# Altium project DCDC_SAUVC26_PCB.PrjPcb
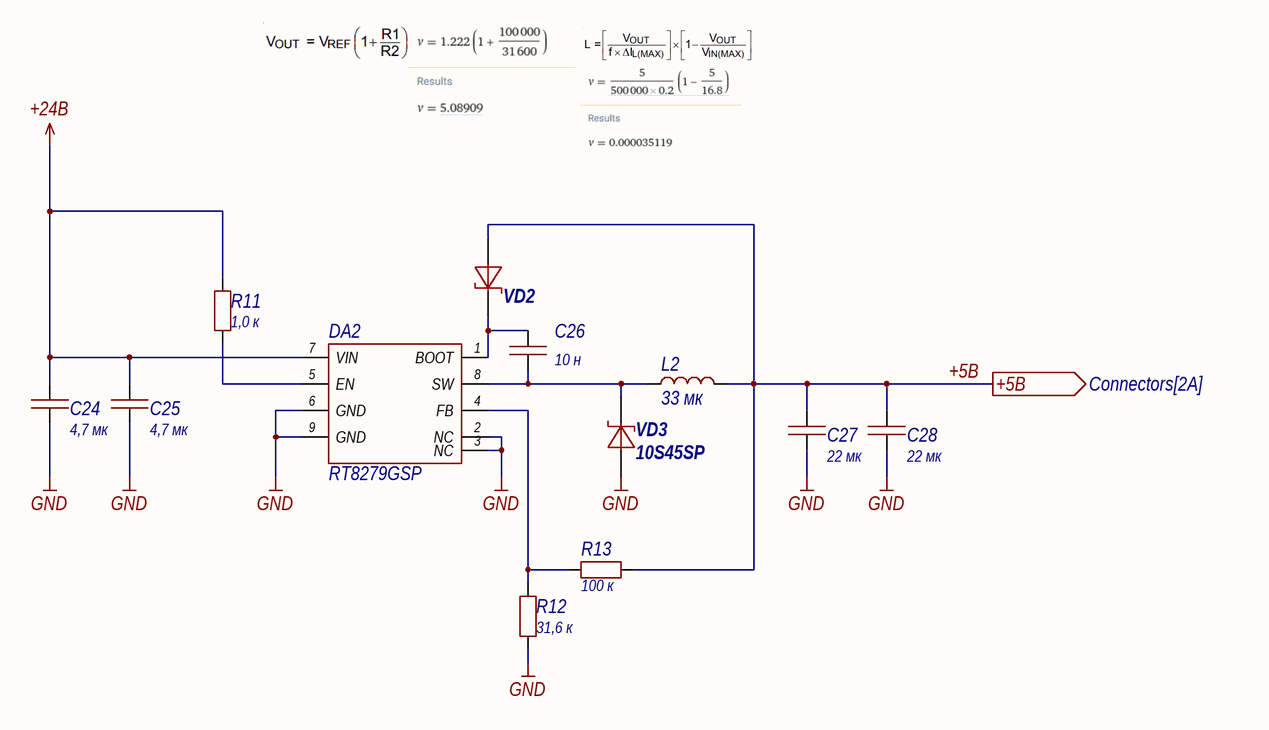
[diagram p0: DCDC_5V.SchDoc]
CheckedBy: Карманов С.; Decimal_Number_PCB: ГИДР.123456.014; Decimal_Number_Shematic: ГИДР.123456.014; DrawnBy: Михайловский Г.; Release_Date: 14.09.2025; Title: Плата преобразователей постоянного тока; Version: 01
5 sheets, 96 parts. Net scope: flat (ports and power ports of the same name join across sheets).
Board file: DCDC_SAUVC26.PcbDoc
Sheets:
  DCDC_5V.SchDoc
  DCDC_12V_Servo.SchDoc
  DCDC_12V.SchDoc
  DCDC_35V.SchDoc
  Connectors.SchDoc

## Sheet DCDC_5V.SchDoc: Плата преобразователей постоянного тока
size 420 x 297 mm; SheetNumber: 1; SheetTotal: 5

### Parts
C24  value 4,7 мк  [1206C]  (hidden comment: Capacitor)
C25  value 4,7 мк  [1206C]  (hidden comment: Capacitor)
C26  value 10 н  [0603C]  (hidden comment: Capacitor)
C27  value 22 мк  [1210C]  (hidden comment: Capacitor)
C28  value 22 мк  [1210C]  (hidden comment: Capacitor)
DA2  RT8279GSP  [8SOP(Exposed_Pad)]
L2  value 33 мк  [IHLP-4040]  (hidden comment: IHLP4040DZER330M11)
R11  value 1,0 к  [0603R]  (hidden comment: Resistor)
R12  value 31,6 к  [0603R]  (hidden comment: Resistor)
R13  value 100 к  [0603R]  (hidden comment: Resistor)
VD2  BAT54WS  [SOD-323]  (value not drawn)
VD3  10S45SP  [TO-277]

### Ports
+5В (out, see Connectors[2A])

### Nets
+5В: C27.2 C28.2 L2.2 R13.2 VD2.1 ; port +5В
+24В: C24.2 C25.2 DA2.7(VIN) R11.2
GND: C24.1 C25.1 C27.1 C28.1 DA2.2(NC) DA2.3(NC) DA2.6(GND) DA2.9(GND) R12.1 VD3.1
NetC26_1: C26.1 DA2.8(SW) L2.1 VD3.2
NetC26_2: C26.2 DA2.1(BOOT) VD2.2
NetDA2_4: DA2.4(FB) R12.2 R13.1
NetDA2_5: DA2.5(EN) R11.1

### Notes on the sheet
- Перв. примен.
- Справ. №
- Подп. и дата
- Инв. № дубл.
- Взам. инв. №
- Разраб.
- Изм.
- Лист
- № докум.
- Подп.
- Дата
- Лит.
- Масса
- Масштаб
- Пров.
- Т.контр.
- Схема электрическая принципиальная
- Листов
- Инв. № подл.
- Утв.
- Н.контр.
- Копировал
- Формат А3

### Library data of the parts
C24 C25 = Capacitor_4,7u_10_50V_X7R_1206C: Конденсатор; Library Path2: Schematic\Capacitor.SchLib; Tolerance: 0,1; Voltage (V): 50; Dielectric: X7R; Capacity (nF): 4700; Part Number: Capacitor_4,7u_10_50V_X7R_1206C
C26 = Capacitor_10n_10_50V_X7R_0603C: Конденсатор; Library Path2: Schematic\Capacitor.SchLib; Tolerance: 0,1; Voltage (V): 50; Dielectric: X7R; Capacity (nF): 10; Part Number: Capacitor_10n_10_50V_X7R_0603C
C27 C28 = Capacitor_22u_10_25V_X7R_1210C: Конденсатор; Library Path2: Schematic\Capacitor.SchLib; Tolerance: 0,1; Voltage (V): 25; Dielectric: X7R; Capacity (nF): 22000; Part Number: Capacitor_22u_10_25V_X7R_1210C
DA2 = RT8279GSP: Преобразователь постоянного тока понижающий подстраиваемый выход 5А; Part Number: RT8279GSP
L2 = IHLP4040DZER330M11: ЧИП-индуктивность экранированная 33мкГн ±20% 4,4A 94,5мОм 4040; Inductance (μH): 33; Current (A): 4,4; Part Number: IHLP4040DZER330M11
R11 = Resistor_1.0k_1_0603: Резистор номиналом 1,0 кОм и точностью 1%; Power: *; Part Number: Resistor_1.0k_1_0603; Tolerance: 1%
R12 = Resistor_31.6k_1_0603: Резистор номиналом 31,6 кОм и точностью 1%; Power: *; Part Number: Resistor_31.6k_1_0603; Tolerance: 1%
R13 = Resistor_100k_1_0603: Резистор номиналом 100 кОм и точностью 1%; Power: *; Part Number: Resistor_100k_1_0603; Tolerance: 1%
VD2 = BAT54WS: Диод шоттки на 30 В, ном. ток 0.2 А; Voltage nominal (V): 30; Current (A): 0.2; Part Number: BAT54WS
VD3 = 10S45SP: Диод шоттки на 45 В, ном. ток 10 А; Voltage nominal (V): 45; Current (A): 10; Part Number: 10S45SP

## Sheet DCDC_12V_Servo.SchDoc: Плата преобразователей постоянного тока
size 420 x 297 mm; SheetNumber: 2; SheetTotal: 5
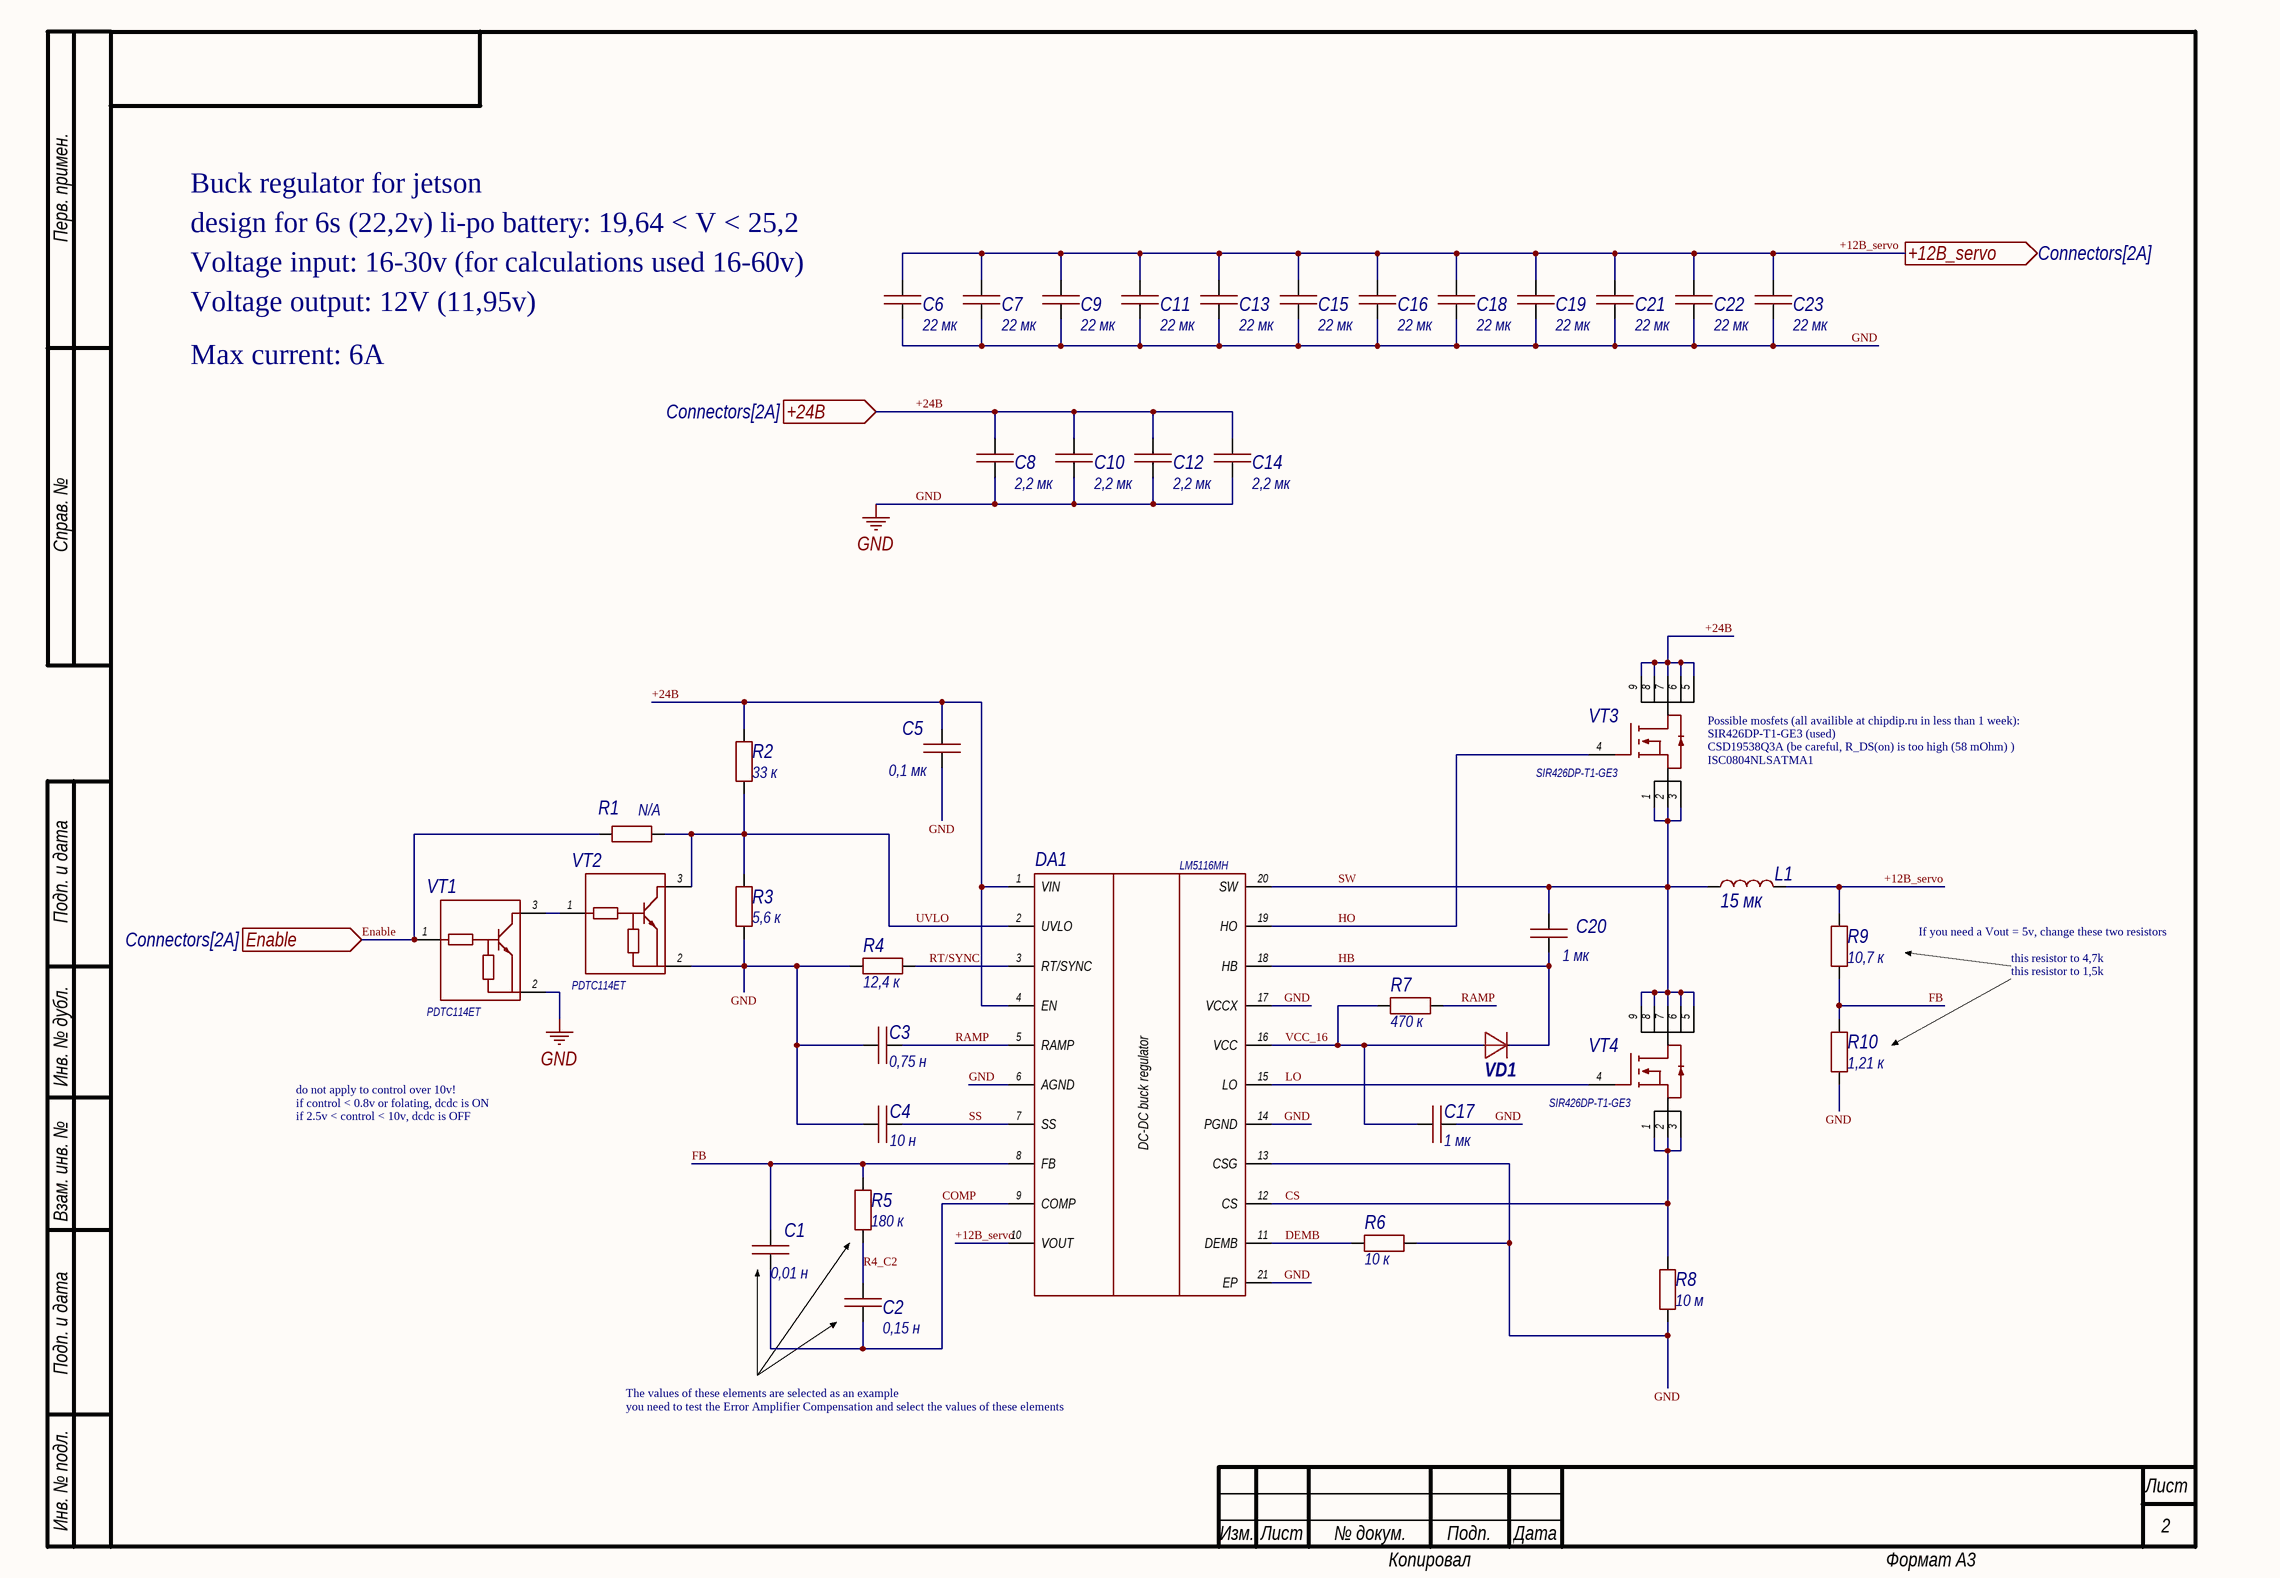
[diagram p1: DCDC_12V_Servo.SchDoc]

### Parts
C1  value 0,01 н  [0603C]  (hidden comment: Capacitor)
C2  value 0,15 н  [0603C]  (hidden comment: Capacitor)
C3  value 0,75 н  [0603C]  (hidden comment: Capacitor)
C4  value 10 н  [0603C]  (hidden comment: Capacitor)
C5  value 0,1 мк  [0603C]  (hidden comment: Capacitor)
C6  value 22 мк  [1210C]  (hidden comment: Capacitor)
C7  value 22 мк  [1210C]  (hidden comment: Capacitor)
C8  value 2,2 мк  [1206C]  (hidden comment: Capacitor)
C9  value 22 мк  [1210C]  (hidden comment: Capacitor)
C10  value 2,2 мк  [1206C]  (hidden comment: Capacitor)
C11  value 22 мк  [1210C]  (hidden comment: Capacitor)
C12  value 2,2 мк  [1206C]  (hidden comment: Capacitor)
C13  value 22 мк  [1210C]  (hidden comment: Capacitor)
C14  value 2,2 мк  [1206C]  (hidden comment: Capacitor)
C15  value 22 мк  [1210C]  (hidden comment: Capacitor)
C16  value 22 мк  [1210C]  (hidden comment: Capacitor)
C17  value 1 мк  [0603C]  (hidden comment: Capacitor)
C18  value 22 мк  [1210C]  (hidden comment: Capacitor)
C19  value 22 мк  [1210C]  (hidden comment: Capacitor)
C20  value 1 мк  [0603C]  (hidden comment: Capacitor)
C21  value 22 мк  [1210C]  (hidden comment: Capacitor)
C22  value 22 мк  [1210C]  (hidden comment: Capacitor)
C23  value 22 мк  [1210C]  (hidden comment: Capacitor)
DA1  LM5116MH  [HTSSOP-20]
L1  value 15 мк  [SPRH127]  (hidden comment: CDSPRH127-150M)
R1  Resistor  [0603R]  (value not drawn)
R2  value 33 к  [0603R]  (hidden comment: Resistor)
R3  value 5,6 к  [0603R]  (hidden comment: Resistor)
R4  value 12,4 к  [0603R]  (hidden comment: Resistor)
R5  value 180 к  [0603R]  (hidden comment: Resistor)
R6  value 10 к  [0603R]  (hidden comment: Resistor)
R7  value 470 к  [0603R]  (hidden comment: Resistor)
R8  value 10 м  [1210R]  (hidden comment: Resistor)
R9  value 10,7 к  [0603R]  (hidden comment: Resistor)
R10  value 1,21 к  [0603R]  (hidden comment: Resistor)
VD1  ES1D-E3/61T  [SMA]  (value not drawn)
VT1  PDTC114ET  [SOT23-3]
VT2  PDTC114ET  [SOT23-3]
VT3  SIR426DP-T1-GE3  [PowerPAK_SO-8]
VT4  SIR426DP-T1-GE3  [PowerPAK_SO-8]

### Ports
+12В_servo (out, see Connectors[2A]), +24В (in, see Connectors[2A]), Enable (in, see Connectors[2A])

### Nets
+12В_servo: C6.2 C7.2 C9.2 C11.2 C13.2 C15.2 C16.2 C18.2 C19.2 C21.2 C22.2 C23.2 DA1.10(VOUT) L1.2 R9.2 ; port +12В_servo
GND: C3.1 C4.1 C5.1 C6.1 C7.1 C8.1 C9.1 C10.1 C11.1 C12.1 C13.1 C14.1 C15.1 C16.1 C17.2 C18.1 C19.1 C21.1 C22.1 C23.1 DA1.6(AGND) DA1.13(CSG) DA1.14(PGND) DA1.17(VCCX) DA1.21(EP) R3.1 R4.1 R6.2 R8.1 R10.1 VT1.2(E) VT2.2(E)
+24В: C5.2 C8.2 C10.2 C12.2 C14.2 DA1.1(VIN) DA1.4(EN) R2.2 VT3.5 VT3.6 VT3.7 VT3.8 VT3.9 ; port +24В
COMP: C1.1 C2.1 DA1.9(COMP)
CS: DA1.12(CS) R8.2 VT4.1 VT4.2 VT4.3
DEMB: DA1.11(DEMB) R6.1
Enable: R1.1 VT1.1(B) ; port Enable
FB: C1.2 DA1.8(FB) R5.2 R9.1 R10.2
HB: C20.1 DA1.18(HB) VD1.2
HO: DA1.19(HO) VT3.4
LO: DA1.15(LO) VT4.4
R4_C2: C2.2 R5.1
RAMP: C3.2 DA1.5(RAMP) R7.2
RT/SYNC: DA1.3(RT/SYNC) R4.2
SS: C4.2 DA1.7(SS)
SW: C20.2 DA1.20(SW) L1.1 VT3.1 VT3.2 VT3.3 VT4.5 VT4.6 VT4.7 VT4.8 VT4.9
UVLO: DA1.2(UVLO) R1.2 R2.1 R3.2 VT2.3(C)
VCC_16: C17.1 DA1.16(VCC) R7.1 VD1.1
NetVT1_3: VT1.3(C) VT2.1(B)

### Notes on the sheet
- design for 6s (22,2v) li-po battery: 19,64 < V < 25,2
- Buck regulator for jetson
- (near C6) Voltage input: 16-30v (for calculations used 16-60v)
- Voltage output: 12V (11,95v)
- Max current: 6A
- (near VT3) Possible mosfets (all availible at chipdip.ru in less than 1 week):
- (near VT3) CSD19538Q3A (be careful, R_DS(on) is too high (58 mOhm) )
- (near VT3) SIR426DP-T1-GE3 (used)
- (near VT3) ISC0804NLSATMA1
- If you need a Vout = 5v, change these two resistors
- this resistor to 4,7k
- this resistor to 1,5k
- if 2.5v < control < 10v, dcdc is OFF
- if control < 0.8v or folating, dcdc is ON
- do not apply to control over 10v!
- The values of these elements are selected as an example
- you need to test the Error Amplifier Compensation and select the values of these elements
- Перв. примен.
- Справ. №
- Подп. и дата
- Инв. № дубл.
- Взам. инв. №
- Инв. № подл.
- Изм.
- Лист
- № докум.
- Подп.
- Дата
- Копировал
- Формат А3
- (in symbol LM5116MH) DC-DC buck regulator

### Library data of the parts
C1 = Capacitor_0,01n_10_50V_X7R_0603C: Конденсатор; Library Path2: Schematic\Capacitor.SchLib; Tolerance: 0,1; Voltage (V): 50; Dielectric: X7R; Capacity (nF): 0,01; Part Number: Capacitor_0,01n_10_50V_X7R_0603C
C2 = Capacitor_0,15n_10_50V_X7R_0603C: Конденсатор; Library Path2: Schematic\Capacitor.SchLib; Tolerance: 0,1; Voltage (V): 50; Dielectric: X7R; Capacity (nF): 0,15; Part Number: Capacitor_0,15n_10_50V_X7R_0603C
C3 = Capacitor_0,75n_10_50V_X7R_0603C: Конденсатор; Library Path2: Schematic\Capacitor.SchLib; Tolerance: 0,1; Voltage (V): 50; Dielectric: X7R; Capacity (nF): 0,75; Part Number: Capacitor_0,75n_10_50V_X7R_0603C
C4 = Capacitor_10n_10_50V_X7R_0603C: as C26 on sheet DCDC_5V; Part Number: Capacitor_10n_10_50V_X7R_0603C
C5 = Capacitor_0,1u_10_50V_X7R_0603C: Конденсатор; Library Path2: Schematic\Capacitor.SchLib; Tolerance: 0,1; Voltage (V): 50; Dielectric: X7R; Capacity (nF): 100; Part Number: Capacitor_0,1u_10_50V_X7R_0603C
C6 C7 C9 C11 C13 C15 C16 C18 C19 C21-C23 = Capacitor_22u_10_25V_X7R_1210C: as C27 on sheet DCDC_5V; Part Number: Capacitor_22u_10_25V_X7R_1210C
C8 C10 C12 C14 = Capacitor_2,2u_10_50V_X7R_1206C: Конденсатор; Library Path2: Schematic\Capacitor.SchLib; Tolerance: 0,1; Voltage (V): 50; Dielectric: X7R; Capacity (nF): 2200; Part Number: Capacitor_2,2u_10_50V_X7R_1206C
C17 C20 = Capacitor_1u_10_50V_X7R_0603C: Конденсатор; Library Path2: Schematic\Capacitor.SchLib; Tolerance: 0,1; Voltage (V): 50; Dielectric: X7R; Capacity (nF): 1000; Part Number: Capacitor_1u_10_50V_X7R_0603C
DA1 = LM5116MH: dc-dc понижающий adj 6-100v; Manufacturer_Part_Number: LM5116MH/NOPB; Part Number: LM5116MH
L1 = CDSPRH127-150M: Индуктивность на 15 мкГн, номинальный ток 8,4 А; Inductance (μH): 15; Current (A): 8,4; Part Number: CDSPRH127-150M
R1 = res_0603_N/A: посадочное место 0603 под перемычку; Tolerance: 1%; Power: *; Value: N/A; Part Number: res_0603_N/A
R2 = Resistor_33k_1_0603: Резистор номиналом 33 кОм и точностью 1%; Power: *; Part Number: Resistor_33k_1_0603; Tolerance: 1%
R3 = Resistor_5.6k_1_0603: Резистор номиналом 5,6 кОм 1%; Power: *; Part Number: Resistor_5.6k_1_0603; Tolerance: 1%
R4 = Resistor_12.4k_1_0603: Резистор номиналом 12,4 кОм и точностью 1%; Power: *; Part Number: Resistor_12.4k_1_0603; Tolerance: 1%
R5 = Resistor_180k_1_0603: Резистор номиналом 180 кОм и точностью 1%; Power: *; Part Number: Resistor_180k_1_0603; Tolerance: 1%
R6 = Resistor_10k_1_0603: Резистор номиналом 10 кОм и точностью 1%; Power: *; Part Number: Resistor_10k_1_0603; Tolerance: 1%
R7 = Resistor_470k_1_0603: Резистор номиналом 470 кОм и точностью 1%; Power: *; Part Number: Resistor_470k_1_0603; Tolerance: 1%
R8 = RL1210FR-070R01L: Резистор номиналом 10 мОм, точностью 1%, 0.5Вт; Power: *; Part Number: RL1210FR-070R01L; Tolerance: 1%
R9 = Resistor_10.7k_1_0603: Резистор номиналом 10,7 кОм и точностью 1%; Power: *; Part Number: Resistor_10.7k_1_0603; Tolerance: 1%
R10 = Resistor_1.21k_1_0603: Резистор номиналом 1,21 кОм и точностью 1%; Power: *; Part Number: Resistor_1.21k_1_0603; Tolerance: 1%
VD1 = ES1D-E3/61T: Диод 1A 200V; Repetitive peak reverse voltage (Vrrm): 200; Current (A): 1; Part Number: ES1D-E3/61T
VT1 VT2 = PDTC114ET: цифровой npn 50в 100мА; Ток макс#: 0, 1 А; Part Number: PDTC114ET; Напряжение С-И/К-Э: 50 В
VT3 VT4 = SIR426DP-T1-GE3: Транзистор полевой MOSFET N-канальный 40В 41.7Вт; Part Number: SIR426DP-T1-GE3; Напряжение С-И/К-Э: 40 В

## Sheet DCDC_12V.SchDoc: Плата преобразователей постоянного тока
size 420 x 297 mm; SheetNumber: 3; SheetTotal: 5
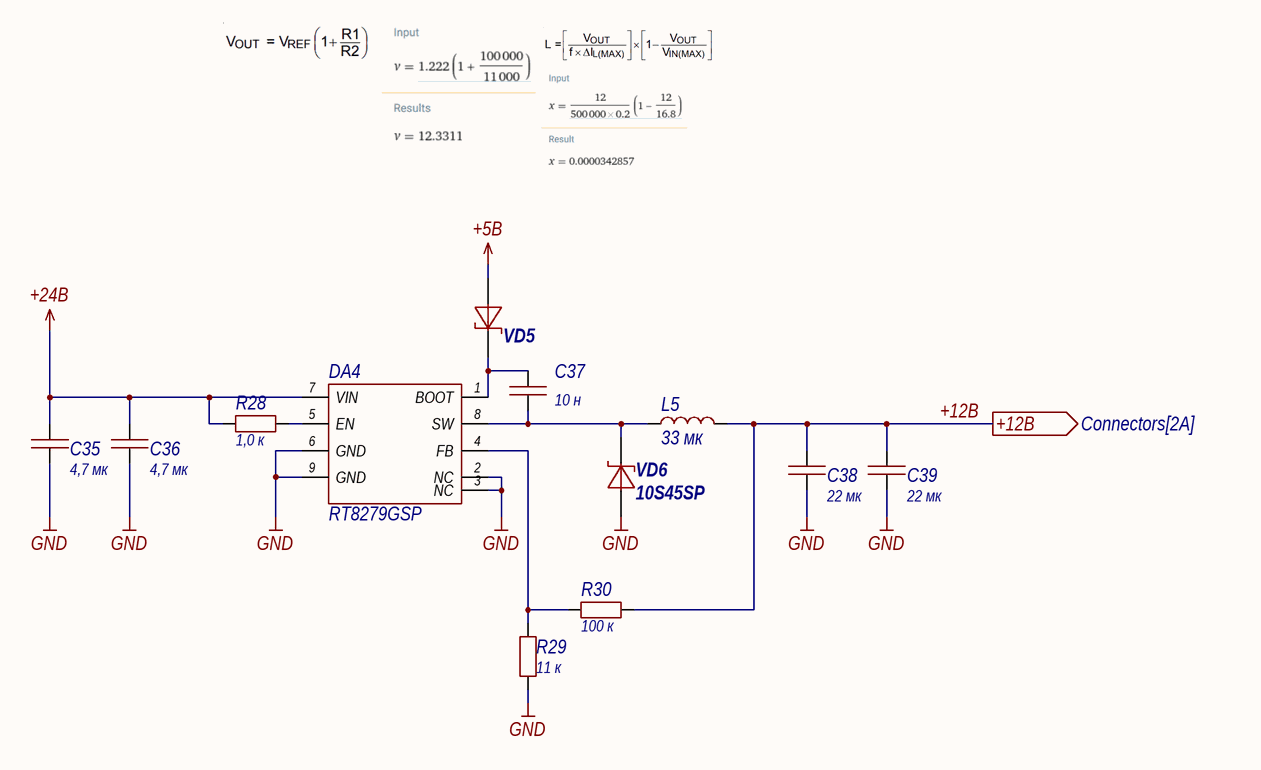
[diagram p2: DCDC_12V.SchDoc]

### Parts
C35  value 4,7 мк  [1206C]  (hidden comment: Capacitor)
C36  value 4,7 мк  [1206C]  (hidden comment: Capacitor)
C37  value 10 н  [0603C]  (hidden comment: Capacitor)
C38  value 22 мк  [1210C]  (hidden comment: Capacitor)
C39  value 22 мк  [1210C]  (hidden comment: Capacitor)
DA4  RT8279GSP  [8SOP(Exposed_Pad)]
L5  value 33 мк  [IHLP-4040]  (hidden comment: IHLP4040DZER330M11)
R28  value 1,0 к  [0603R]  (hidden comment: Resistor)
R29  value 11 к  [0603R]  (hidden comment: Resistor)
R30  value 100 к  [0603R]  (hidden comment: Resistor)
VD5  BAT54WS  [SOD-323]  (value not drawn)
VD6  10S45SP  [TO-277]

### Ports
+12В (out, see Connectors[2A])

### Nets
+5В: VD5.1
+12В: C38.2 C39.2 L5.2 R30.2 ; port +12В
+24В: C35.2 C36.2 DA4.7(VIN) R28.2
GND: C35.1 C36.1 C38.1 C39.1 DA4.2(NC) DA4.3(NC) DA4.6(GND) DA4.9(GND) R29.1 VD6.1
NetC37_1: C37.1 DA4.8(SW) L5.1 VD6.2
NetC37_2: C37.2 DA4.1(BOOT) VD5.2
NetDA4_4: DA4.4(FB) R29.2 R30.1
NetDA4_5: DA4.5(EN) R28.1

### Notes on the sheet
- Перв. примен.
- Справ. №
- Подп. и дата
- Инв. № дубл.
- Взам. инв. №
- Инв. № подл.
- Изм.
- Лист
- № докум.
- Подп.
- Дата
- Копировал
- Формат А3

### Library data of the parts
C35 C36 = Capacitor_4,7u_10_50V_X7R_1206C: as C24 on sheet DCDC_5V; Part Number: Capacitor_4,7u_10_50V_X7R_1206C
C37 = Capacitor_10n_10_50V_X7R_0603C: as C26 on sheet DCDC_5V; Part Number: Capacitor_10n_10_50V_X7R_0603C
C38 C39 = Capacitor_22u_10_25V_X7R_1210C: as C27 on sheet DCDC_5V; Part Number: Capacitor_22u_10_25V_X7R_1210C
DA4 = RT8279GSP: as DA2 on sheet DCDC_5V; Part Number: RT8279GSP
L5 = IHLP4040DZER330M11: as L2 on sheet DCDC_5V; Part Number: IHLP4040DZER330M11
R28 = Resistor_1.0k_1_0603: as R11 on sheet DCDC_5V; Power: *; Part Number: Resistor_1.0k_1_0603; Tolerance: 1%
R29 = Resistor_11k_1_0603: Резистор номиналом 11 кОм и точностью 1%; Power: *; Part Number: Resistor_11k_1_0603; Tolerance: 1%
R30 = Resistor_100k_1_0603: as R13 on sheet DCDC_5V; Power: *; Part Number: Resistor_100k_1_0603; Tolerance: 1%
VD5 = BAT54WS: as VD2 on sheet DCDC_5V; Part Number: BAT54WS
VD6 = 10S45SP: as VD3 on sheet DCDC_5V; Part Number: 10S45SP

## Sheet DCDC_35V.SchDoc: Плата преобразователей постоянного тока
size 420 x 297 mm; SheetNumber: 4; SheetTotal: 5
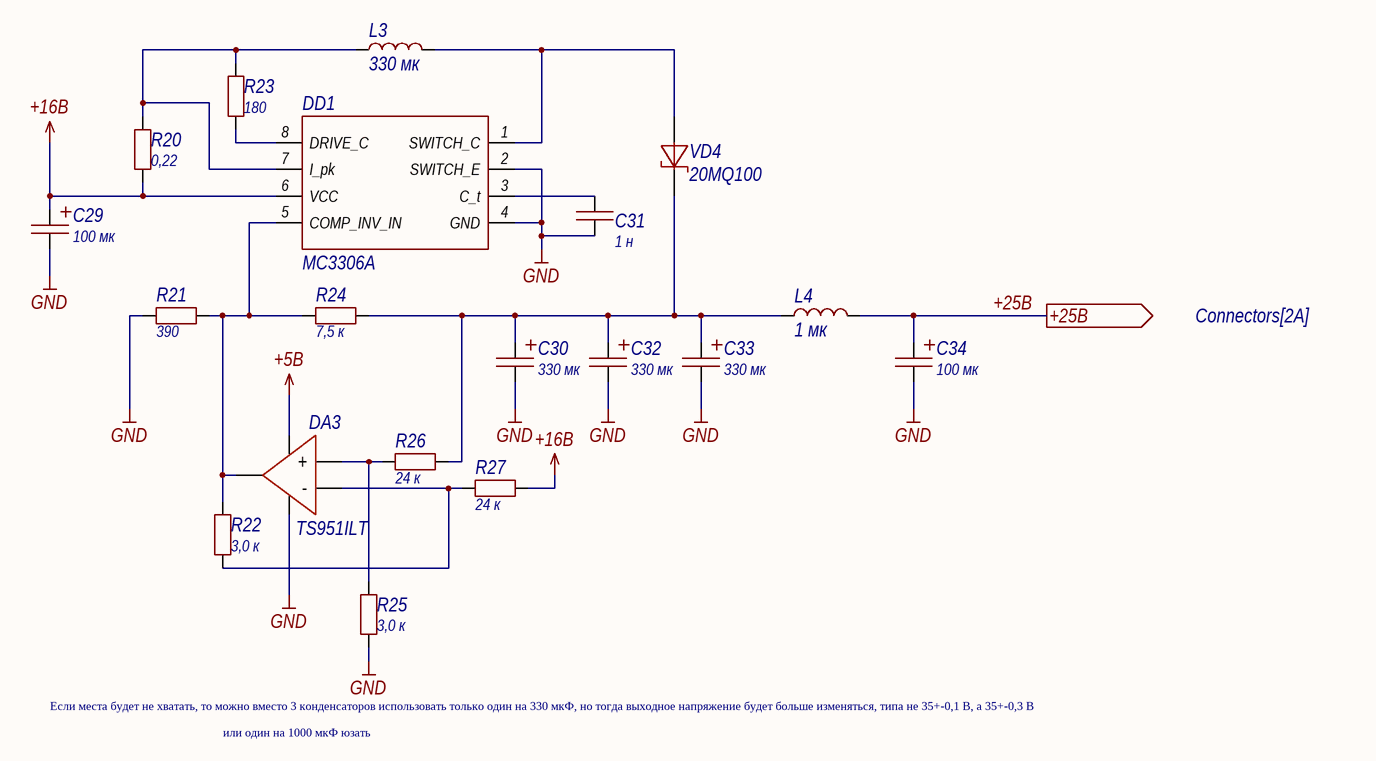
[diagram p3: DCDC_35V.SchDoc]

### Parts
C29  value 100 мк  [ECAP_SMD_6,6x6,6]  (hidden comment: Capacitor)
C30  value 330 мк  [ECAP_SMD_10,3x10,3]  (hidden comment: Capacitor)
C31  value 1 н  [0603C]  (hidden comment: Capacitor)
C32  value 330 мк  [ECAP_SMD_10,3x10,3]  (hidden comment: Capacitor)
C33  value 330 мк  [ECAP_SMD_10,3x10,3]  (hidden comment: Capacitor)
C34  value 100 мк  [ECAP_SMD_6,6x6,6]  (hidden comment: Capacitor)
DA3  TS951ILT  [SOt23-5]
DD1  MC3306A  [SOIC-8]
L3  value 330 мк  [12.8x12.8]  (hidden comment: CDSPRH127-331M)
L4  value 1 мк  [4.5x4_wired]  (hidden comment: CDSP43-1R0M)
R20  value 0,22  [2512R]  (hidden comment: Resistor)
R21  value 390  [0603R]  (hidden comment: Resistor)
R22  value 3,0 к  [0603R]  (hidden comment: Resistor)
R23  value 180  [0603R]  (hidden comment: Resistor)
R24  value 7,5 к  [0603R]  (hidden comment: Resistor)
R25  value 3,0 к  [0603R]  (hidden comment: Resistor)
R26  value 24 к  [0603R]  (hidden comment: Resistor)
R27  value 24 к  [0603R]  (hidden comment: Resistor)
VD4  20MQ100  [SMA]

### Ports
+25В (out, see Connectors[2A])

### Nets
+5В: DA3.5(VCC)
+16В: C29.1 DD1.6(VCC) R20.2 R27.1
+25В: C34.1 L4.2 ; port +25В
GND: C29.2 C30.2 C31.1 C32.2 C33.2 C34.2 DA3.2(GND) DD1.2(SWITCH_E) DD1.4(GND) R21.1 R25.2
NetC30_1: C30.1 C32.1 C33.1 L4.1 R24.2 R26.1 VD4.2
NetC31_2: C31.2 DD1.3(C_t)
NetDA3_1: DA3.1 DD1.5(COMP_INV_IN) R21.2 R22.1 R24.1
NetDA3_3: DA3.3(+) R25.1 R26.2
NetDA3_4: DA3.4(-) R22.2 R27.2
NetDD1_1: DD1.1(SWITCH_C) L3.2 VD4.1
NetDD1_7: DD1.7(I_pk) L3.1 R20.1 R23.2
NetDD1_8: DD1.8(DRIVE_C) R23.1

### Notes on the sheet
- Если места будет не хватать, то можно вместо 3 конденсаторов использовать только один на 330 мкФ, но тогда выходное напряжение будет больше изменяться, типа не 35+-0,1 В, а 35+-0,3 В
- или один на 1000 мкФ юзать
- Перв. примен.
- Справ. №
- Подп. и дата
- Инв. № дубл.
- Взам. инв. №
- Инв. № подл.
- Изм.
- Лист
- № докум.
- Подп.
- Дата
- Копировал
- Формат А3

### Library data of the parts
C29 C34 = JCK1V101: Конденсатор алюминиевый электролитический 100мкФ 35В 20% SMD 6,6x6,6 мм; Tolerance: 20; Voltage (V): 35; Type: SMD Aluminum; Capacity (uF): 100; Part Number: JCK1V101
C30 C32 C33 = JCK1V331: Конденсатор алюминиевый электролитический 1000мкФ 25В 20% Low ESR 1100мА SMD12.5x13.5мм; Tolerance: 20; Voltage (V): 35; Type: SMD Aluminum; Capacity (uF): 330; Part Number: JCK1V331
C31 = Capacitor_1n_10_50V_X7R_0603C: Конденсатор; Library Path2: Schematic\Capacitor.SchLib; Tolerance: 0,1; Voltage (V): 50; Dielectric: X7R; Capacity (nF): 1; Part Number: Capacitor_1n_10_50V_X7R_0603C
DA3 = TS951ILT: Операционный усилитель Rail-to-Rail, 1-канальный; Part Number: TS951ILT
DD1 = MC3306A: DC-DC понижающий/повышающий преобразователь, вход: 3 - 40 В, выход: 1,25 - 40 В 1,5 А; Part Number: MC3306A
L3 = CDSPRH127-331M: Индуктивность на 330 мкГн, номинальный ток 1,79 A; Inductance (μH): 330; Current (A): 1,79; Part Number: CDSPRH127-331M
L4 = CDSP43-1R0M: Индуктивность на 1 мкГн, номинальный ток 4,3 A; Inductance (μH): 1; Current (A): 4,3; Part Number: CDSP43-1R0M
R20 = Resistor_0.22_1_2512: Резистор номиналом 0,22 Ом и точностью 1%; Power: *; Part Number: Resistor_0.22_1_2512; Tolerance: 1%
R21 = Resistor_390_1_0603: Резистор номиналом 390 Ом 1%; Power: *; Part Number: Resistor_390_1_0603; Tolerance: 1%
R22 R25 = Resistor_3.0k_1_0603: Резистор номиналом 3,0 кОм и точностью 1%; Power: *; Part Number: Resistor_3.0k_1_0603; Tolerance: 1%
R23 = Resistor_180_1_0603: Резистор номиналом 180 Ом и точностью 1%; Power: *; Part Number: Resistor_180_1_0603; Tolerance: 1%
R24 = Resistor_7.5k_1_0603: Резистор номиналом 7,5 кОм 1%; Power: *; Part Number: Resistor_7.5k_1_0603; Tolerance: 1%
R26 R27 = Resistor_24k_1_0603: Резистор номиналом 24 кОм и точностью 1%; Power: *; Part Number: Resistor_24k_1_0603; Tolerance: 1%
VD4 = 20MQ100: Диод шоттки на 100 В, ном. ток 2 А; Voltage nominal (V): 100; Current (A): 2; Part Number: 20MQ100

## Sheet Connectors.SchDoc: Плата преобразователей постоянного тока
size 420 x 297 mm; SheetNumber: 5; SheetTotal: 5
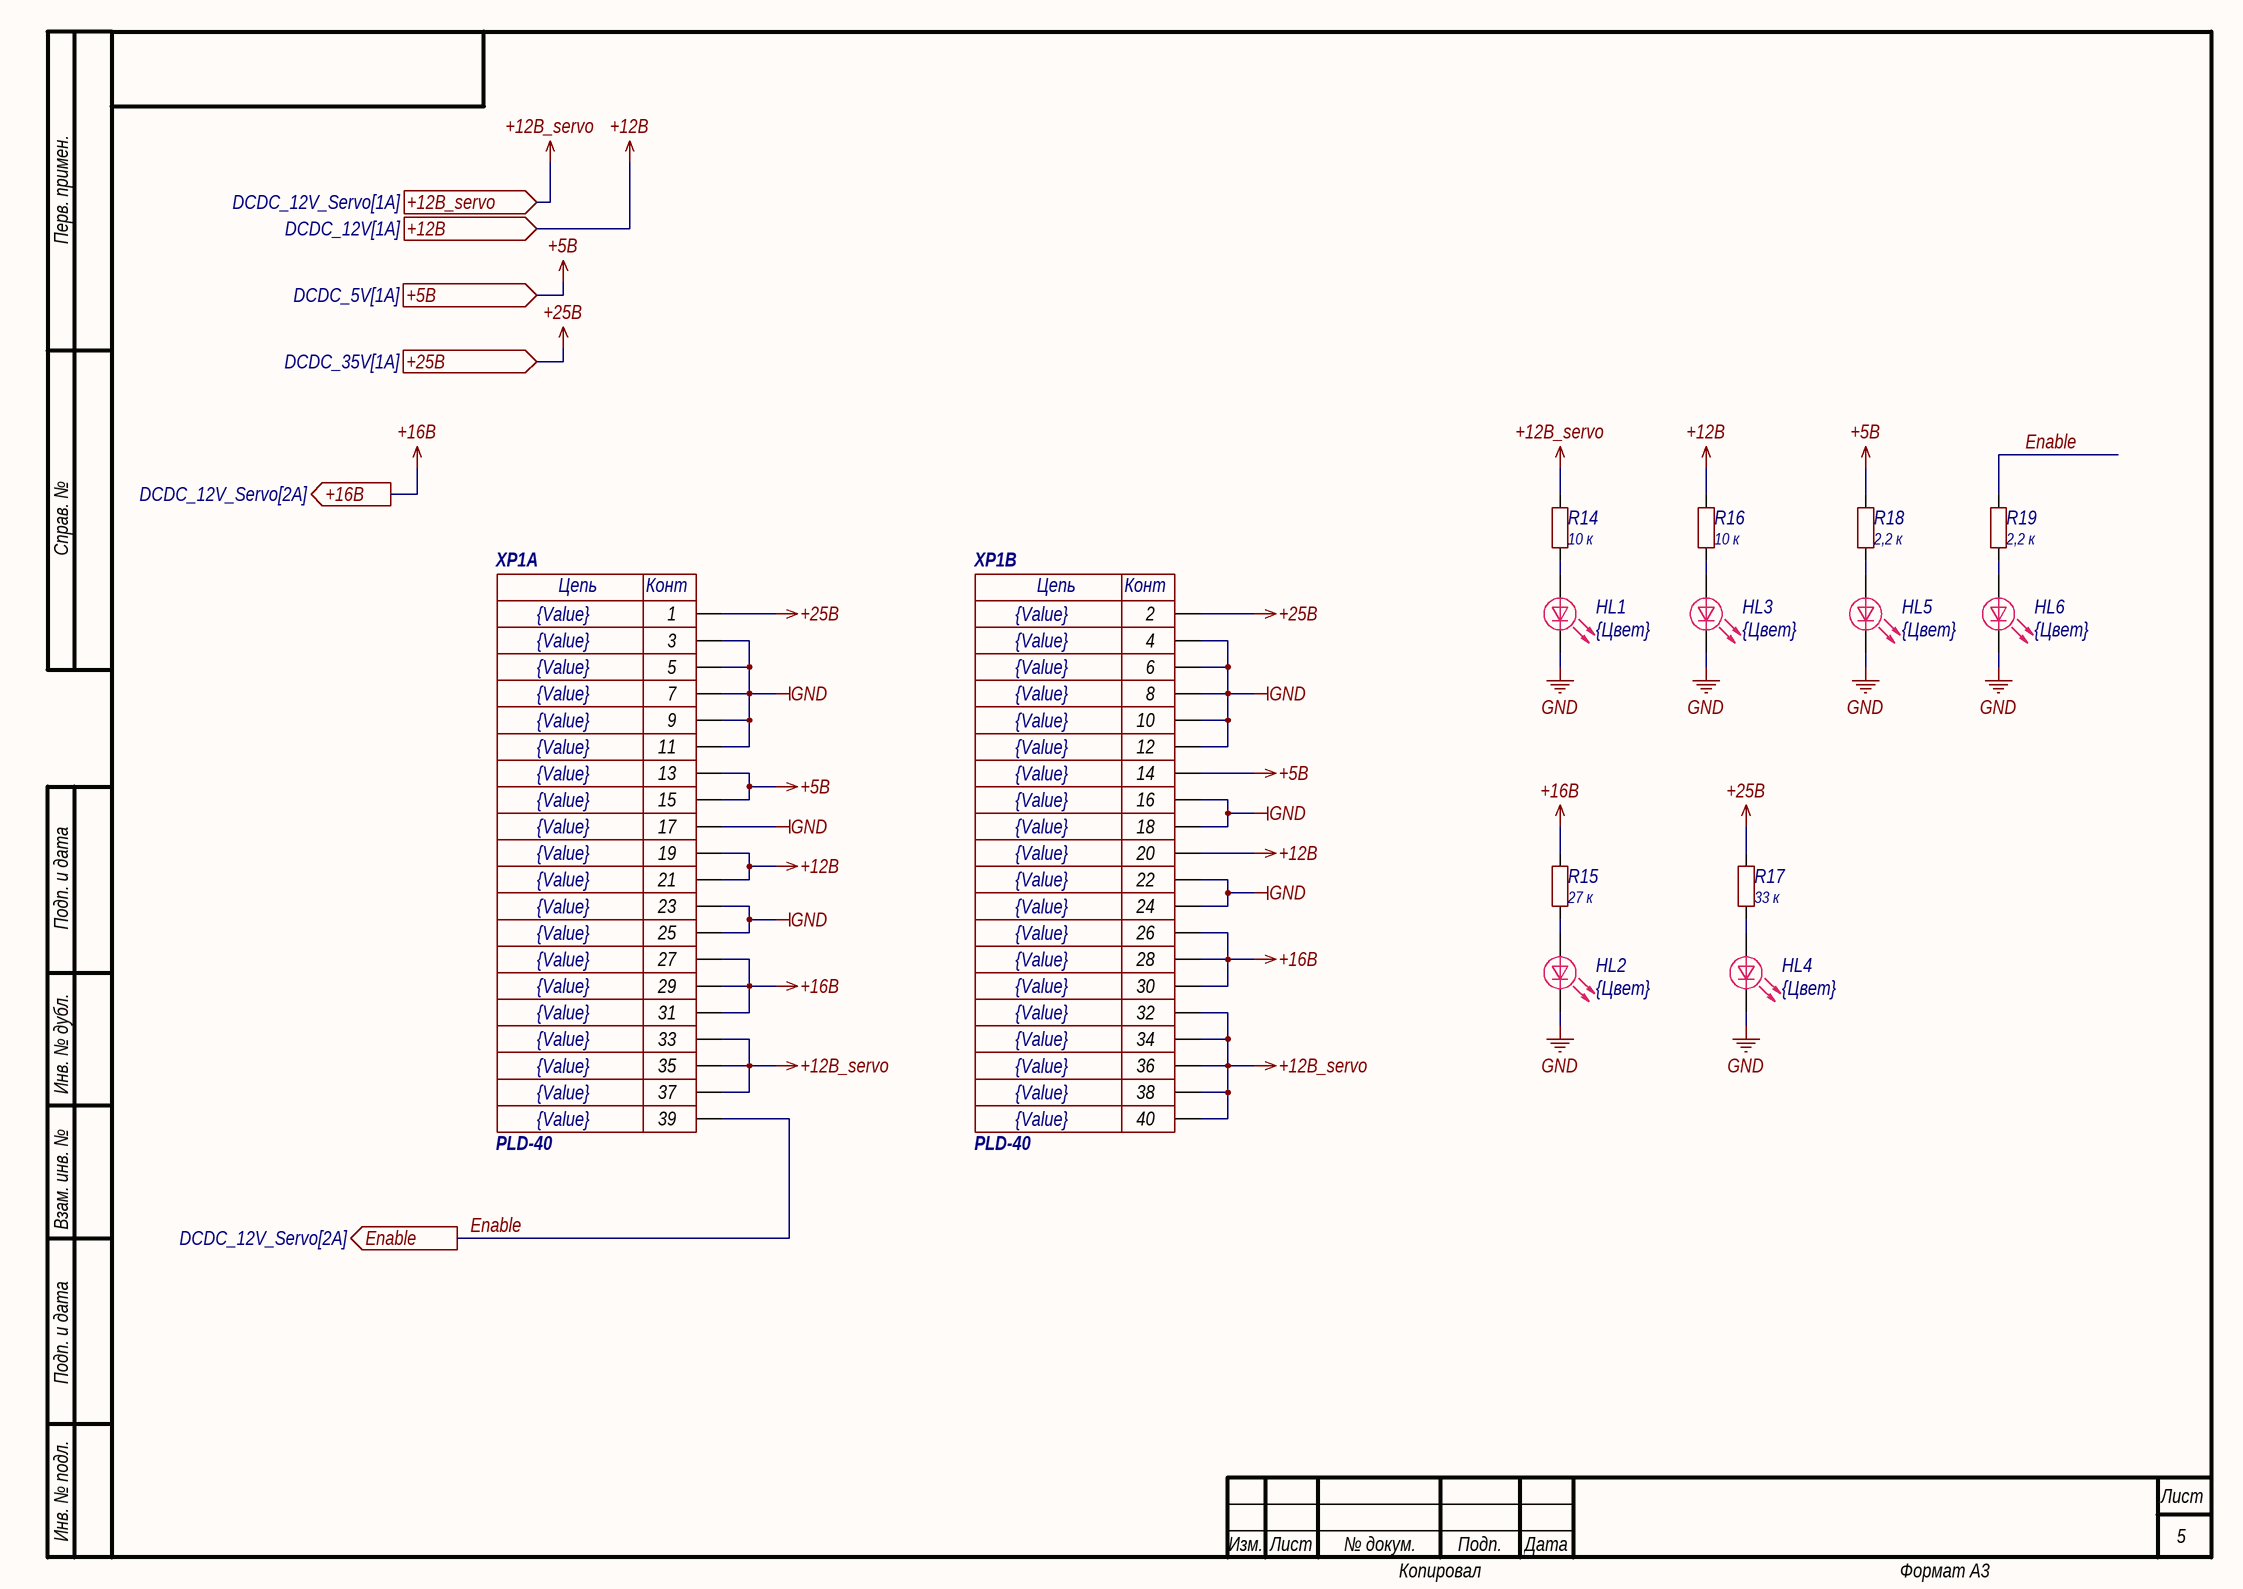
[diagram p4: Connectors.SchDoc]

### Parts
HL1  Color: {Цвет}  [0805D]  (hidden comment: LED)
HL2  Color: {Цвет}  [0805D]  (hidden comment: LED)
HL3  Color: {Цвет}  [0805D]  (hidden comment: LED)
HL4  Color: {Цвет}  [0805D]  (hidden comment: LED)
HL5  Color: {Цвет}  [0805D]  (hidden comment: LED)
HL6  Color: {Цвет}  [0805D]  (hidden comment: LED)
R14  value 10 к  [0603R]  (hidden comment: Resistor)
R15  value 27 к  [0603R]  (hidden comment: Resistor)
R16  value 10 к  [0603R]  (hidden comment: Resistor)
R17  value 33 к  [0603R]  (hidden comment: Resistor)
R18  value 2,2 к  [0603R]  (hidden comment: Resistor)
R19  value 2,2 к  [0603R]  (hidden comment: Resistor)
XP1  PLD-40  Value17: {Value}  [PLD40]  (parts A,B of 2)

### Ports
+5В (in, see DCDC_5V[1A]), +12В (in, see DCDC_12V[1A]), +12В_servo (in, see DCDC_12V_Servo[1A]), +16В (out, see DCDC_12V_Servo[2A]), +25В (in, see DCDC_35V[1A]), Enable (out, see DCDC_12V_Servo[2A])

### Nets
+5В: R18.2 XP1.13 XP1.14 XP1.15 ; port +5В
+12В: R16.2 XP1.19 XP1.20 XP1.21 ; port +12В
+12В_servo: R14.2 XP1.32 XP1.33 XP1.34 XP1.35 XP1.36 XP1.37 XP1.38 XP1.40 ; port +12В_servo
+16В: R15.2 XP1.26 XP1.27 XP1.28 XP1.29 XP1.30 XP1.31 ; port +16В
+25В: R17.2 XP1.1 XP1.2 ; port +25В
GND: HL1.2 HL2.2 HL3.2 HL4.2 HL5.2 HL6.2 XP1.3 XP1.4 XP1.5 XP1.6 XP1.7 XP1.8 XP1.9 XP1.10 XP1.11 XP1.12 XP1.16 XP1.17 XP1.18 XP1.22 XP1.23 XP1.24 XP1.25
Enable: R19.2 XP1.39 ; port Enable
NetHL1_1: HL1.1 R14.1
NetHL2_1: HL2.1 R15.1
NetHL3_1: HL3.1 R16.1
NetHL4_1: HL4.1 R17.1
NetHL5_1: HL5.1 R18.1
NetHL6_1: HL6.1 R19.1

### Notes on the sheet
- Перв. примен.
- Справ. №
- Подп. и дата
- Инв. № дубл.
- Взам. инв. №
- Инв. № подл.
- Изм.
- Лист
- № докум.
- Подп.
- Дата
- Копировал
- Формат А3
- (in symbol PLD-40, part A) Цепь; Конт
- (in symbol PLD-40, part B) Цепь; Конт

### Library data of the parts
HL1-HL6 = LED: Светодиод; Part Number: LED
R14 R16 = Resistor_10k_1_0603: Резистор номиналом 10 кОм и точностью 1%; Power: *; Part Number: Resistor_10k_1_0603; Tolerance: 1%
R15 = Resistor_27k_1_0603: Резистор номиналом 27 кОм и точностью 1%; Power: *; Part Number: Resistor_27k_1_0603; Tolerance: 1%
R17 = Resistor_33k_1_0603: Резистор номиналом 33 кОм и точностью 1%; Power: *; Part Number: Resistor_33k_1_0603; Tolerance: 1%
R18 R19 = Resistor_2.2k_1_0603: Резистор номиналом 2,2 кОм и точностью 1%; Power: *; Part Number: Resistor_2.2k_1_0603; Tolerance: 1%
XP1 = PLD-40: Гребенка 40 пинов; System: Connector; Value20: {Value}; Value19: {Value}; Value18: {Value}; Value16: {Value}; Value15: {Value}; Value14: {Value}; Value13: {Value}; Value12: {Value}; Value11: {Value}; Value10: {Value}; Value9: {Value}; Value8: {Value}; Value7: {Value}; Value6: {Value}; Value5: {Value}; Value4: {Value}; Value3: {Value}; Value2: {Value}; Value1: {Value}; Part Number: PLD-40; Datasheet: https://static.chipdip.ru/lib/177/DOC040177951.pdf

## Nets that join several sheets
+5В: DCDC_5V (5 pins), DCDC_12V (VD5.1), DCDC_35V (DA3.5), Connectors (R18.2 XP1.13 XP1.14 XP1.15)
+12В: DCDC_12V (C38.2 C39.2 L5.2 R30.2), Connectors (R16.2 XP1.19 XP1.20 XP1.21)
+12В_servo: DCDC_12V_Servo (15 pins), Connectors (9 pins)
+16В: DCDC_35V (C29.1 DD1.6 R20.2 R27.1), Connectors (7 pins)
+24В: DCDC_5V (C24.2 C25.2 DA2.7 R11.2), DCDC_12V (C35.2 C36.2 DA4.7 R28.2)
+25В: DCDC_35V (C34.1 L4.2), Connectors (R17.2 XP1.1 XP1.2)
GND: DCDC_5V (10 pins), DCDC_12V_Servo (32 pins), DCDC_12V (10 pins), DCDC_35V (11 pins), Connectors (23 pins)
Enable: DCDC_12V_Servo (R1.1 VT1.1), Connectors (R19.2 XP1.39)

## Assembly variants
01: not fitted DA3 R22 R25 R26 R27
02: not fitted R21 R24